# EAGLE design Hocki-IR-Receiver (EAGLE 9.6.2)
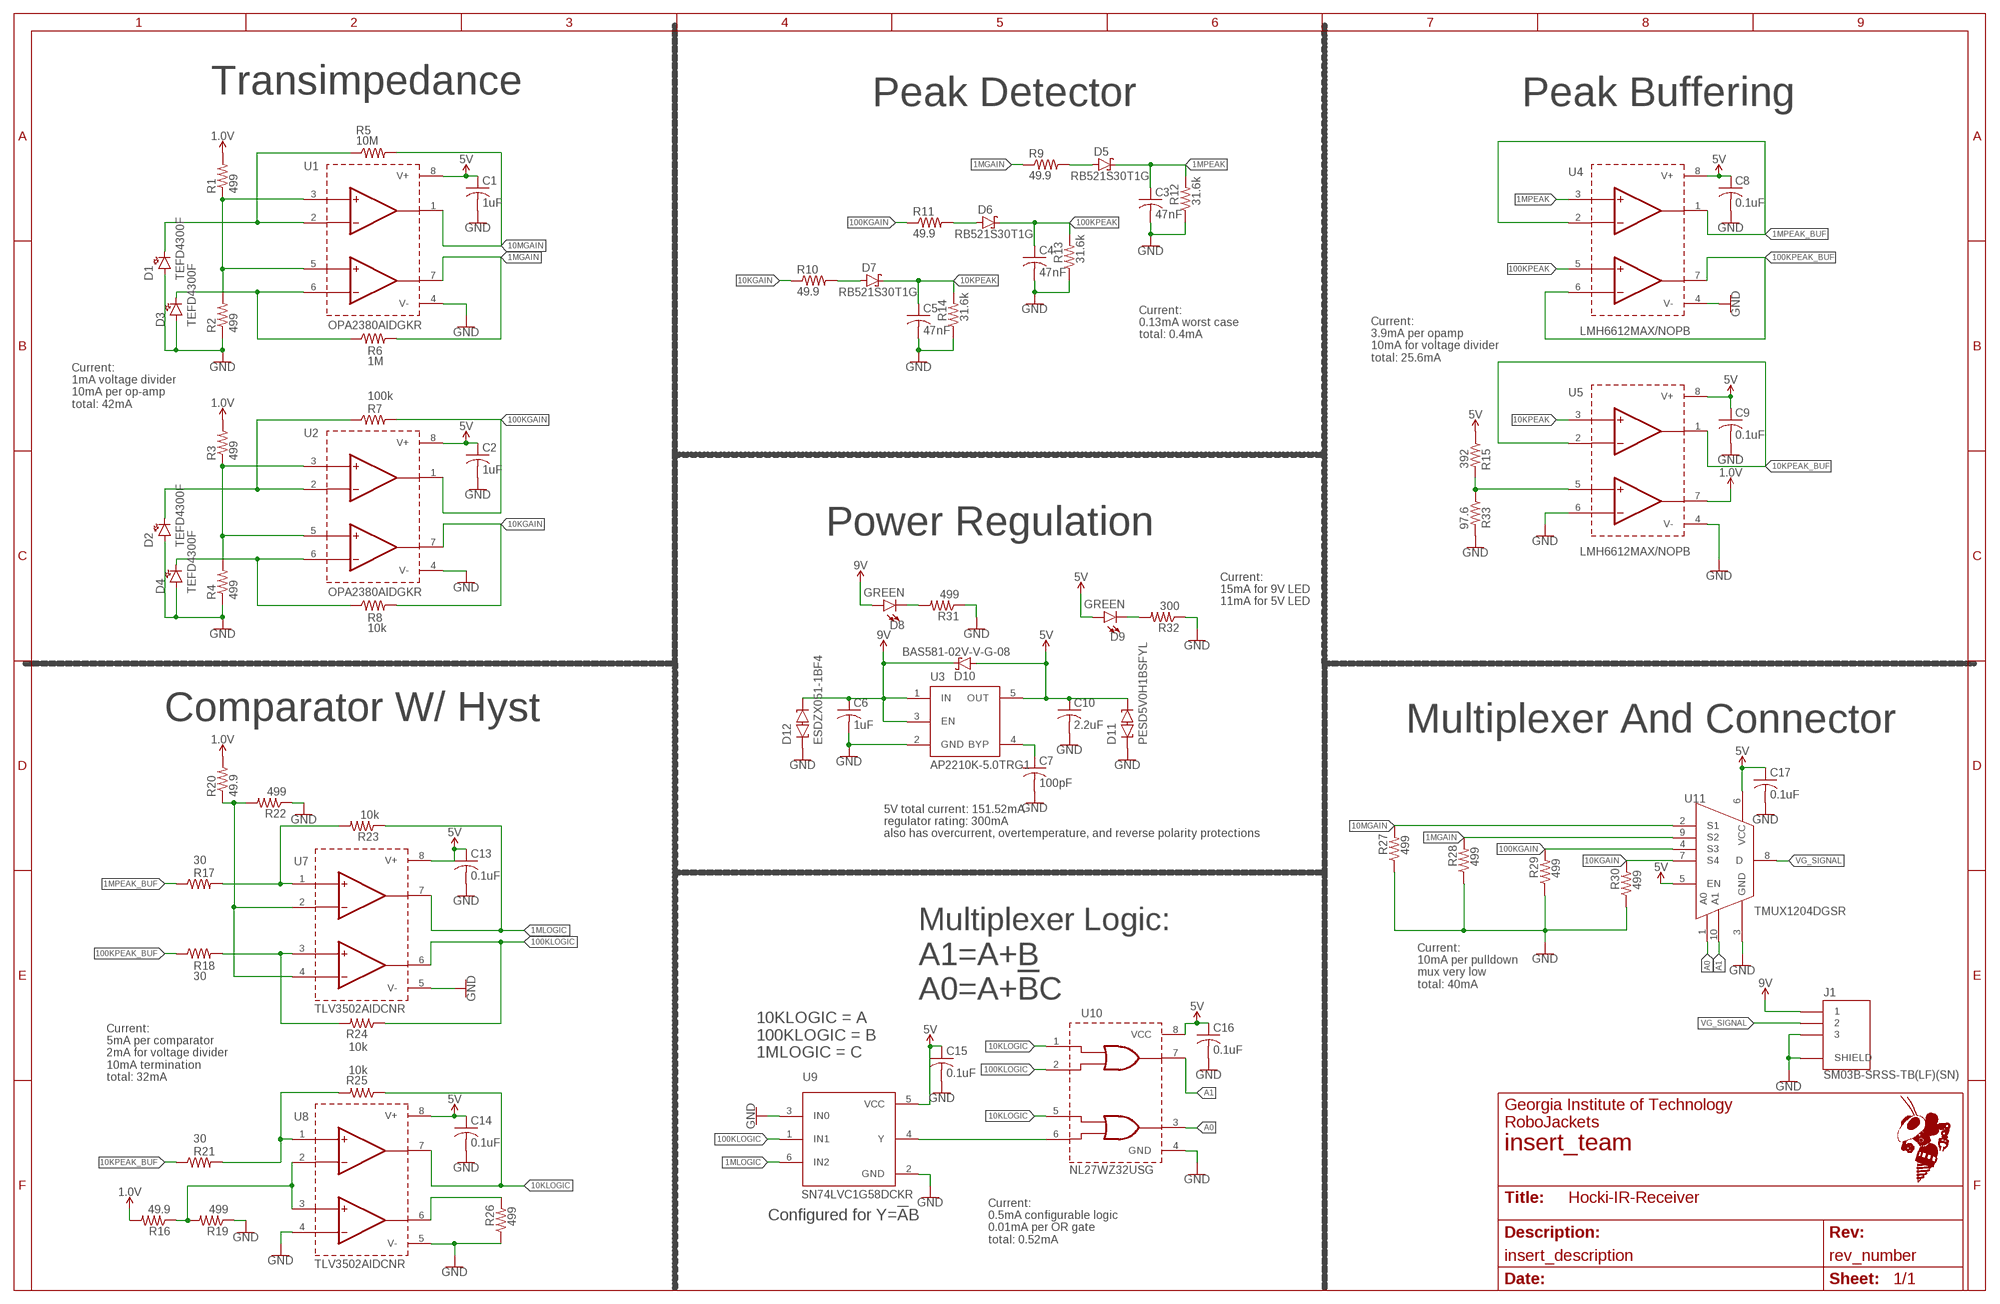
[diagram p0: schematic, sheet 1]
FRAME1 (FRAME_11_17): REVISION: rev_number; SCH_DESC: insert_description; TEAM: insert_team

## Parts
C1  1uF  C-USC0603  [C0603]
C2  1uF  C-USC0603  [C0603]
C3  47nF  C-USC1206  [C1206]
C4  47nF  C-USC1206  [C1206]
C5  47nF  C-USC1206  [C1206]
C6  1uF  C-USC0603  [C0603]
C7  100pF  C-USC0603  [C0603]
C8  0.1uF  C-USC0603  [C0603]
C9  0.1uF  C-USC0603  [C0603]
C10  2.2uF  C-USC0603  [C0603]
C13  0.1uF  C-USC0603  [C0603]
C14  0.1uF  C-USC0603  [C0603]
C15  0.1uF  C-USC0603  [C0603]
C16  0.1uF  C-USC0603  [C0603]
C17  0.1uF  C-USC0603  [C0603]
D1  TEFD4300F  [TEFD4300F]
D2  TEFD4300F  [TEFD4300F]
D3  TEFD4300F  [TEFD4300F]
D4  TEFD4300F  [TEFD4300F]
D5  RB521S30T1G  [SOD-523]
D6  RB521S30T1G  [SOD-523]
D7  RB521S30T1G  [SOD-523]
D8  GREEN  LED-GREEN0603  [LED-0603]
D9  GREEN  LED-GREEN0603  [LED-0603]
D10  BAS581-02V-V-G-08  [SOD-523]
D11  PESD5V0H1BSFYL  [DSN0603-2]
D12  ESDZX051-1BF4  [DSN0603-2]
J1  SM03B-SRSS-TB(LF)(SN)  [SM03B-SRSS-TB(LF)(SN)]
R1  499  R-US_R0603  [R0603]
R2  499  R-US_R0603  [R0603]
R3  499  R-US_R0603  [R0603]
R4  499  R-US_R0603  [R0603]
R5  10M  R-US_R1206  [R1206]
R6  1M  R-US_R0603  [R0603]
R7  100k  R-US_R0603  [R0603]
R8  10k  R-US_R0603  [R0603]
R9  49.9  R-US_R0603  [R0603]
R10  49.9  R-US_R0603  [R0603]
R11  49.9  R-US_R0603  [R0603]
R12  31.6k  R-US_R0603  [R0603]
R13  31.6k  R-US_R0603  [R0603]
R14  31.6k  R-US_R0603  [R0603]
R15  392  R-US_R0603  [R0603]
R16  49.9  R-US_R0603  [R0603]
R17  30  R-US_R0603  [R0603]
R18  30  R-US_R0603  [R0603]
R19  499  R-US_R0603  [R0603]
R20  49.9  R-US_R0603  [R0603]
R21  30  R-US_R0603  [R0603]
R22  499  R-US_R0603  [R0603]
R23  10k  R-US_R0603  [R0603]
R24  10k  R-US_R0603  [R0603]
R25  10k  R-US_R0603  [R0603]
R26  499  R-US_R0603  [R0603]
R27  499  R-US_R0603  [R0603]
R28  499  R-US_R0603  [R0603]
R29  499  R-US_R0603  [R0603]
R30  499  R-US_R0603  [R0603]
R31  499  R-US_R0603  [R0603]
R32  300  R-US_R0603  [R0603]
R33  97.6  R-US_R0603  [R0603]
U1  OPA2380AIDGKR  [8-VSSOP]
U2  OPA2380AIDGKR  [8-VSSOP]
U3  AP2210K-5.0TRG1  [SOT-23-5]
U4  LMH6612MAX/NOPB  [8-SOIC]
U5  LMH6612MAX/NOPB  [8-SOIC]
U7  TLV3502AIDCNR  [SOT-23-8]
U8  TLV3502AIDCNR  [SOT-23-8]
U9  SN74LVC1G58DCKR  [SC-70-6]
U10  NL27WZ32USG  [US8]
U11  TMUX1204DGSR  [10-VSSOP]

## Nets
1.0V: R1.2 R3.2 R16.2 R20.2 U5.7(OUTB)
1MGAIN: R6.2 R9.1 R28.2 U1.7(OUTB) U11.9(S2)
1MLOGIC: R23.1 U7.7(OUTA) U9.6(IN2)
1MPEAK: C3.1 D5.1(C) R12.2 U4.3(INA+)
1MPEAK_BUF: R17.1 U4.1(OUTA) U4.2(INA-)
5V: C1.1 C2.1 C8.1 C9.1 C10.1 C13.1 C14.1 C15.1 C16.1 C17.1 D9.A D10.2(A) D11.C2 R15.1 U1.8(V+) U2.8(V+) U3.5(OUT) U4.8(V+) U5.8(V+) U7.8(V+) U8.8(V+) U9.5(VCC) U10.8(VCC) U11.5(EN) U11.6(VCC)
9V: C6.1 D8.A D10.1(C) D12.C2 J1.1 U3.1(IN) U3.3(EN)
10KGAIN: R8.2 R10.1 R30.2 U2.7(OUTB) U11.7(S4)
10KLOGIC: R25.1 U8.7(OUTA) U10.1(A1) U10.5(A2)
10KPEAK: C5.1 D7.1(C) R14.2 U5.3(INA+)
10KPEAK_BUF: R21.1 U5.1(OUTA) U5.2(INA-)
10MGAIN: R5.2 R27.2 U1.1(OUTA) U11.2(S1)
100KGAIN: R7.2 R11.1 R29.2 U2.1(OUTA) U11.4(S3)
100KLOGIC: R24.1 U7.6(OUTB) U9.1(IN1) U10.2(B1)
100KPEAK: C4.1 D6.1(C) R13.2 U4.5(INB+)
100KPEAK_BUF: R18.1 U4.6(INB-) U4.7(OUTB)
A0: U10.3(Y2) U11.1(A0)
A1: U10.7(Y1) U11.10(A1)
GND: C1.2 C2.2 C3.2 C4.2 C5.2 C6.2 C7.2 C8.2 C9.2 C10.2 C13.2 C14.2 C15.2 C16.2 C17.2 D1.1(ANODE) D2.1(ANODE) D3.1(ANODE) D4.1(ANODE) D11.C1 D12.C1 J1.3 J1.S1(SHIELD) J1.S2(SHIELD) R2.1 R4.1 R12.1 R13.1 R14.1 R19.1 R22.1 R26.1 R27.1 R28.1 R29.1 R30.1 R31.1 R32.1 R33.2 U1.4(V-) U2.4(V-) U3.2(GND) U4.4(V-) U5.4(V-) U5.6(INB-) U7.5(V-) U8.4(INB-) U8.5(V-) U9.2(GND) U9.3(IN0) U10.4(GND) U11.3(GND)
N$1: D1.2(CATHODE) R5.1 U1.2(INA-)
N$2: D6.2(A) R11.2
N$3: D3.2(CATHODE) R6.1 U1.6(INB-)
N$4: D7.2(A) R10.2
N$5: R1.1 R2.2 U1.3(INA+) U1.5(INB+)
N$6: D2.2(CATHODE) R7.1 U2.2(INA-)
N$7: R26.2 U8.6(OUTB)
N$8: C7.1 U3.4(BYP)
N$9: U9.4(Y) U10.6(B2)
N$10: D4.2(CATHODE) R8.1 U2.6(INB-)
N$11: D9.C R32.2
N$12: R3.1 R4.2 U2.3(INA+) U2.5(INB+)
N$13: R20.1 R22.2 U7.2(INA-) U7.4(INB-)
N$14: R16.1 R19.2 U8.2(INA-) U8.3(INB+)
N$15: R15.2 R33.1 U5.5(INB+)
N$20: R18.2 R24.2 U7.3(INB+)
N$21: D5.2(A) R9.2
N$22: R21.2 R25.2 U8.1(INA+)
N$23: R17.2 R23.2 U7.1(INA+)
N$24: D8.C R31.2
VG_SIGNAL: J1.2 U11.8(D)

## Notes on the sheet
- Transimpedance | Peak Detector | Peak Buffering
- Current:
  0.13mA worst case
  total: 0.4mA
- Current:
  3.9mA per opamp
  10mA for voltage divider
  total: 25.6mA
- Current:
  1mA voltage divider
  10mA per op-amp
  total: 42mA
- Power Regulation
- Current:
  15mA for 9V LED
  11mA for 5V LED
- Comparator W/ Hyst | Multiplexer And Connector
- 5V total current: 151.52mA
  regulator rating: 300mA
  also has overcurrent, overtemperature, and reverse polarity protections
- Current:
  10mA per pulldown
  mux very low
  total: 40mA
- Multiplexer Logic:
  A1=A+B
  A0=A+!B!C
- 10KLOGIC = A
  100KLOGIC = B
  1MLOGIC = C
- Current:
  5mA per comparator
  2mA for voltage divider
  10mA termination
  total: 32mA
- Configured for Y=!A!B
- Current:
  0.5mA configurable logic
  0.01mA per OR gate
  total: 0.52mA

## Library data of the parts
C1-C10 C13-C17 = rcl:C-US: CAPACITOR, American symbol; SPICEPREFIX: C
D1-D4 = Hocki_Library:TEFD4300F: Photodiode 950nm 100ns 40° Radial DigiKey <https://www.digikey.com/product-detail/en/vishay-semiconductor-opto-division/TEFD4300F/TEFD4300F-ND/2987578>; DKPN: TEFD4300F-ND
D5-D7 = Hocki_Library:RB521S30T1G
D8 D9 = SparkFun-LED:LED-GREEN: Green SMD LED Used in manufacturing of various products at SparkFun Packages: 0603 - SMD 0603 package [Product Link] <http://www.futureelectronics.com/en/technologies/semiconductors/optoelectronics/leds/Pages/9894312-LTST-C190GKT.aspx?CrossPart=HSMG-C190&IM=0> LilyPad 1206 - SMD1206 LilyPad package [Product Link] <http://www.futureelectronics.com/en/Technologies/Product.aspx?ProductID=IN150NGHARVATEKCORPORATION2049943&IM=0> 1206 - SMD1206 package [Product Link] <http://www.futureelectronics.com/en/technologies/semiconductors/optoelectronics/leds/Pages/8315665-LTST-C150KGKT.aspx?IM=0> 1206 Bottom Mount -SMD 1206 Bottom Mount [Product Link] <http://www.digikey.com/product-detail/en/lite-on-inc/LTST-C230KGKT/160-1456-1-ND/386854> SparkFun Products: Pro Mini 328 -5V <https://www.sparkfun.com/products/821> RedBoard <https://www.sparkfun.com/products/12757> MP3 Trigger <https://www.sparkfun.com/products/13720> Makey Makey <https://www.sparkfun.com/products/11076>; PROD_ID: DIO-00821
D10 = Hocki_Library:BAS581-02V-V-G-08: Diode Schottky 40V 200mA Surface Mount SOD-523 DigiKey <https://www.digikey.com/product-detail/en/vishay-semiconductor-diodes-division/BAS581-02V-V-G-08/112-BAS581-02V-V-G-08CT-ND/8564684>; DKPN: 112-BAS581-02V-V-G-08CT-ND
D11 = Hocki_Library:PESD5V0H1BSFYL: 5V Clamp 7A (8/20µs) Ipp Tvs Diode Surface Mount DSN0603-2 DigiKey <https://www.digikey.com/product-detail/en/nexperia-usa-inc/PESD5V0H1BSFYL/1727-2675-1-ND/6576108>; DKPN: 1727-2675-1-ND
D12 = Hocki_Library:ESDZX051-1BF4: 10V (Typ) Clamp 4A (8/20µs) Ipp Tvs Diode Surface Mount ST0201 DigiKey <https://www.digikey.com/product-detail/en/stmicroelectronics/ESDZX051-1BF4/497-ESDZX051-1BF4CT-ND/12749584>; DKPN: 497-ESDZX051-1BF4CT-ND
J1 = Hocki_Library:SM03B-SRSS-TB(LF)(SN): Connector Header Surface Mount, Right Angle 3 position 0.039" (1.00mm) DigiKey <https://www.digikey.com/product-detail/en/jst-sales-america-inc/SM03B-SRSS-TB-LF-SN/455-1803-1-ND/926874>; DKPN: 455-1803-1-ND
R1-R4 R6-R33 = resistor:R-US_: RESISTOR, American symbol
R5 = rcl:R-US_: RESISTOR, American symbol; SPICEPREFIX: R
U1 U2 = Hocki_Library:OPA2380AIDGKR: Transimpedance Amplifier 2 Circuit 8-VSSOP Digikey <https://www.digikey.com/product-detail/en/texas-instruments/OPA2380AIDGKR/296-48627-1-ND/8567671>; DKPN: 296-48627-1-ND
U3 = Hocki_Library:AP2210K-*TRG1: Linear Voltage Regulator IC 1 Output 300mA SOT-23-5 3.3V DigiKey <https://www.digikey.com/product-detail/en/diodes-incorporated/AP2210K-3-3TRG1/AP2210K-3-3TRG1DICT-ND/4505291> 5.0V DigiKey <https://www.digikey.com/product-detail/en/diodes-incorporated/AP2210K-5-0TRG1/AP2210K-5-0TRG1DICT-ND/4505292>; DKPN: AP2210K-5.0TRG1DICT-ND
U4 U5 = Hocki_Library:LMH6612MAX/NOPB: General Purpose Amplifier 2 Circuit Rail-to-Rail 8-SOIC DigiKey <https://www.digikey.com/product-detail/en/texas-instruments/LMH6612MAX-NOPB/296-46310-1-ND/7033484>; DKPN: 296-46310-1-ND
U7 U8 = Hocki_Library:TLV3502AIDCNR: Comparator General Purpose CMOS, Push-Pull, Rail-to-Rail, TTL SOT-23-8 DigiKey <https://www.digikey.com/product-detail/en/texas-instruments/TLV3502AIDCNR/296-39267-1-ND/5143259>; DKPN: 296-39267-1-ND
U9 = Hocki_Library:SN74LVC1G58DCKR: Configurable Multiple Function Configurable 1 Circuit 3 Input SC-70-6 DigiKey< <https://www.digikey.com/product-detail/en/texas-instruments/SN74LVC1G58DCKR/296-15577-1-ND/571153>; DKPN: 296-15577-1-ND
U10 = Hocki_Library:NL27WZ32USG: OR Gate IC 2 Channel US8 DigiKey <https://www.digikey.com/product-detail/en/on-semiconductor/NL27WZ32USG/NL27WZ32USGOSCT-ND/964591>; DKPN: NL27WZ32USGOSCT-ND
U11 = Hocki_Library:TMUX1204DGSR: Multiplexer 1 Circuit IC Switch 4:1 5Ohm (Typ) 10-VSSOP DigiKey <https://www.digikey.com/product-detail/en/texas-instruments/TMUX1204DGSR/296-TMUX1204DGSRCT-ND/10435076>; DKPN: 296-TMUX1204DGSRCT-ND

## Board
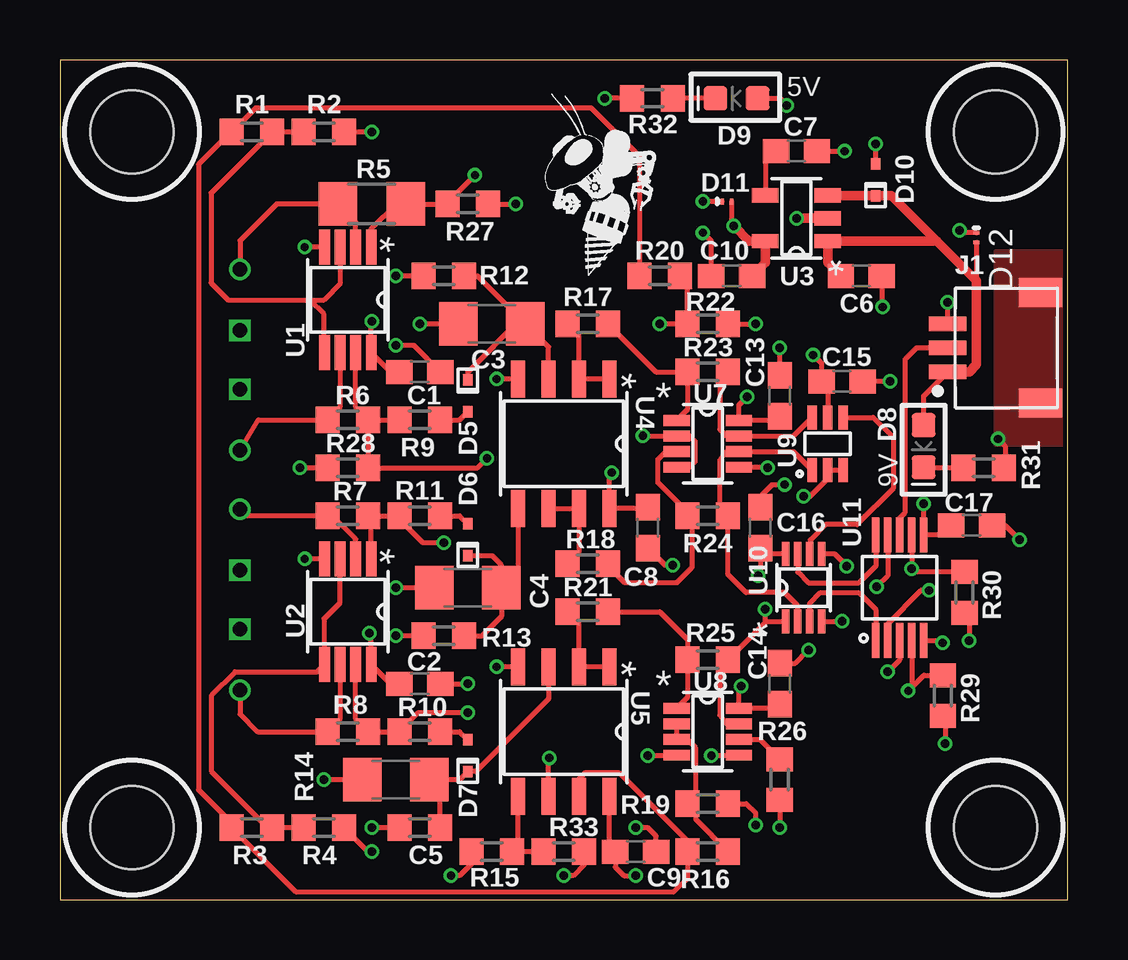
[diagram p1: board, top side]
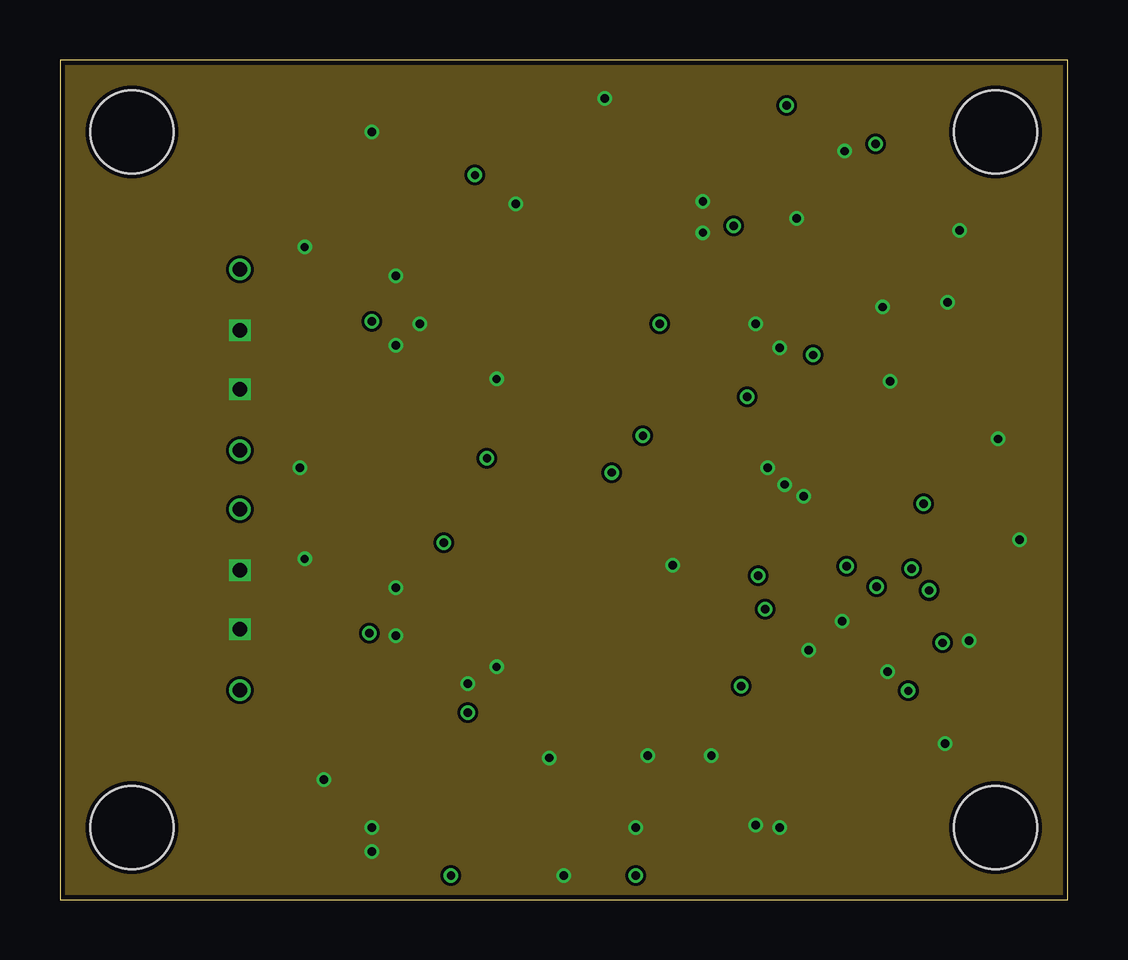
[diagram p2: board, inner layer GND]
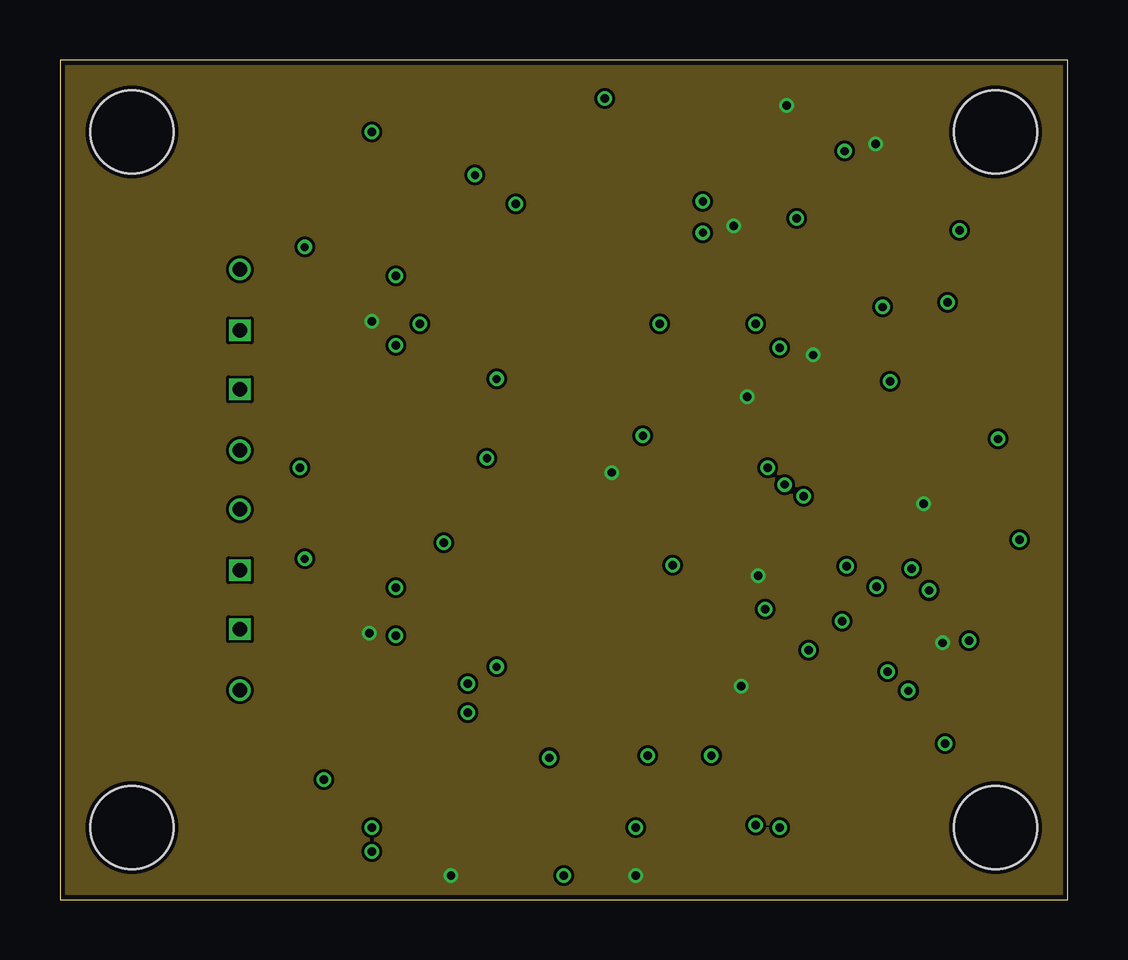
[diagram p3: board, inner layer Power]
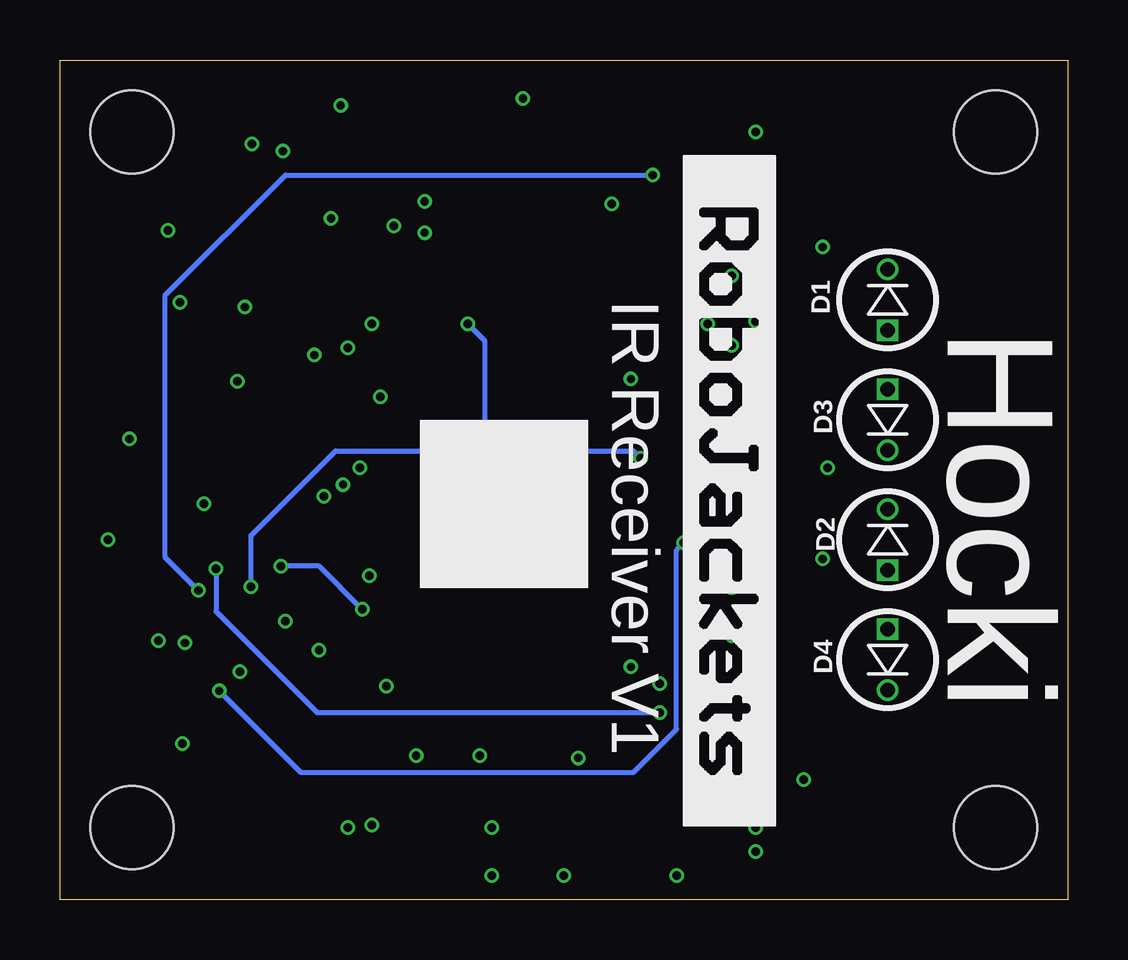
[diagram p4: board, bottom side, seen from below]

Size 42 x 35 mm. Coordinates in mm from the lower left corner, seen from the top.
Outline: 0,0 42,0 42,35 0,35 0,0
Copper layers (1+2*15+16): Top 0.035mm / dielectric 0.2mm / GND 0.0175mm / dielectric 1.065mm / Power 0.0175mm / dielectric 0.2mm / Bottom 0.035mm
Design rules "JLCPCB (4 Layer)": minimum track width 5mil, minimum drill 0.2mm, track to track 5mil, track to pad 5mil, pad to pad 5mil, via to via 20mil, smd to smd 5mil, copper to edge 0.2mm, drill to drill 21mil, minimum pad ring 6mil, minimum via ring 5mil, stop-mask expansion 6mil, vias tented up to drill 30mil, thermal gap 10mil
Holes 3.45 mm at 39,3 39,32 3,32 3,3

### Footprints (pad centres in the part's own frame; a part is rotated, then mirrored left to right if it is on the bottom)
C0603 = smd 1.1 x 1: 1 -0.85,0; 2 0.85,0
C1206 = smd 1.6 x 1.8: 1 -1.4,0; 2 1.4,0
TEFD4300F = drill 0.6 square: 1 -1.27,0 | drill 0.6: 2 1.27,0
SOD-523 = smd 0.48 x 0.4: 1 -0.66,0; 2 0.66,0
LED-0603 = smd 1 x 1: A -0.877,0; C 0.877,0
DSN0603-2 = smd 0.15 x 0.25: C1 -0.2,0; C2 0.2,0
SM03B-SRSS-TB(LF)(SN) = smd 0.6 x 1.55: 1 -1,0; 2 0,0; 3 1,0 | smd 1.2 x 1.8: S1 -2.3,-3.875; S2 2.3,-3.875
R0603 = smd 1 x 1.1: 1 -0.85,0; 2 0.85,0
R1206 = smd 1.6 x 1.803: 1 -1.422,0; 2 1.422,0
8-VSSOP = smd 1.45 x 0.45: 1 -2.2,0.975; 2 -2.2,0.325; 3 -2.2,-0.325; 4 -2.2,-0.975; 5 2.2,-0.975; 6 2.2,-0.325; 7 2.2,0.325; 8 2.2,0.975
SOT-23-5 = smd 1.1 x 0.6: 1 -1.3,0.95; 2 -1.3,0; 3 -1.3,-0.95; 4 1.3,-0.95; 5 1.3,0.95
8-SOIC = smd 1.55 x 0.6: 1 -2.7,1.905; 2 -2.7,0.635; 3 -2.7,-0.635; 4 -2.7,-1.905; 5 2.7,-1.905; 6 2.7,-0.635; 7 2.7,0.635; 8 2.7,1.905
SOT-23-8 = smd 1.1 x 0.45: 1 -1.3,0.975; 2 -1.3,0.325; 3 -1.3,-0.325; 4 -1.3,-0.975; 5 1.3,-0.975; 6 1.3,-0.325; 7 1.3,0.325; 8 1.3,0.975
SC-70-6 = smd 1 x 0.4: 1 -1.1,0.65; 2 -1.1,0; 3 -1.1,-0.65; 4 1.1,-0.65; 5 1.1,0; 6 1.1,0.65
US8 = smd 1 x 0.3: 1 -1.4,0.75; 2 -1.4,0.25; 3 -1.4,-0.25; 4 -1.4,-0.75; 5 1.4,-0.75; 6 1.4,-0.25; 7 1.4,0.25; 8 1.4,0.75
10-VSSOP = smd 1.45 x 0.3: 1 -2.2,1; 2 -2.2,0.5; 3 -2.2,0; 4 -2.2,-0.5; 5 -2.2,-1; 6 2.2,-1; 7 2.2,-0.5; 8 2.2,0; 9 2.2,0.5; 10 2.2,1

### Placement (x,y rotation side)
C1  15,22 0 top
C2  15,9 0 top
C3  18,24 180 top
C4  17,13 180 top
C5  14,5 180 top
C6  33.4,26 0 top
C7  30.7,31.2 0 top
C8  24.5,15.5 270 top
C9  24,2 0 top
C10  28,26 180 top
C13  30,21 90 top
C14  30,9 90 top
C15  32.6,21.6 0 top
C16  29.2,15.5 90 top
C17  38,15.6 0 top
D1  7.5,25 90 bottom
D2  7.5,15 90 bottom
D3  7.5,20 270 bottom
D4  7.5,10 270 bottom
D5  17,21 270 top
D6  17,15 90 top
D7  17,6 90 top
D8  36,18.9 270 top
D9  28.2,33.4 180 top
D10  34,30 90 top
D11  27.8,29.1 0 top
D12  38.2,27.6 270 top
J1  37,23 90 top
R1  8,32 180 top
R2  11,32 180 top
R3  8,3 180 top
R4  11,3 180 top
R5  13,29 0 top
R6  12,20 0 top
R7  12,16 0 top
R8  12,7 0 top
R9  15,20 0 top
R10  15,7 0 top
R11  15,16 0 top
R12  16,26 0 top
R13  16,11 0 top
R14  15,3 0 top
R15  18,2 0 top
R16  27,2 180 top
R17  22,24 0 top
R18  22,14 0 top
R19  27,4 180 top
R20  25,26 180 top
R21  22,12 0 top
R22  27,24 180 top
R23  27,22 180 top
R24  27,16 180 top
R25  27,10 180 top
R26  30,5 90 top
R27  17,29 180 top
R28  12,18 0 top
R29  36.8,8.5 90 top
R30  37.7,12.8 90 top
R31  38.5,18 180 top
R32  24.7,33.4 0 top
R33  21,2 0 top
U1  12,25 270 top
U2  12,12 270 top
U3  30.7,28.4 180 top
U4  21,19 270 top
U5  21,7 270 top
U7  27,19 0 top
U8  27,7 0 top
U9  32,19 90 top
U10  31,13 90 top
U11  35,13 90 top
U$1  [ROBOBUZZ_0.4X]  22,26 0 top
U$2  [ROBOJACKETS]  16,31 270 bottom

### Tracks (layer width: path | path; a pad name or v marks a point on that pad's centre or on a via)
1.0V
  Top 0.2: R20.2 24.15,31 22.15,33 8.15,33 R1.2 7.12,32 5.77,30.65 5.77,4.58 7.15,3.2 R3.2 9.83,0.32 25.6,0.32 26.15,0.87 R16.2 26.15,2.45 23.3,5.3 21.91,5.3 21.64,5.03 U5.7
1MGAIN  (via drill 0.35)
  Top 0.2: U11.9 34.5,13.5 v34.05,13.05 | R6.2 12.32,20.52 U1.7 | v17.8,18.4 17.4,18 R28.2 R6.2 | R6.2 R9.1
  Bottom 0.2: v34.05,13.05 34.05,15.16 30.51,18.7 18.1,18.7 v17.8,18.4
1MLOGIC
  Top 0.2: R23.1 27.5,21.65 27.5,19.6 27.77,19.32 U7.7 30.57,19.32 U9.6
1MPEAK
  Top 0.2: 19.2,24.2 C3.1 20.36,23.04 U4.3 | 19.2,24.2 17.4,26 R12.2 | D5.1 17,22 19.2,24.2
1MPEAK_BUF
  Top 0.2: U4.1 U4.2 21.64,23.52 R17.1
5V  (via drill 0.35)
  Top 0.2: C1.1 13.78,22 U1.8 12.97,24.07 v13,24.1 | C2.1 13.78,9 U2.8 12.97,11.01 v12.89,11.1 | U5.8 22.91,2.25 C9.1 23.15,1.35 23.5,1 v24,1 | C14.1 29.82,7.97 U8.8 28.3,8.79 v28.4,8.89 | C8.1 24.45,16.3 U4.8 22.91,17.7 v23,17.8 | C13.1 29.82,19.98 U7.8 28.3,20.61 v28.64,20.96 | C17.1 36.75,15.2 U11.6 v36,16.5 | U11.5 36.69,10.8 v36.79,10.7 | U10.8 29.45,14.4 C16.1 29.2,13.6 v29.1,13.5 | D9.A 30,33.4 v30.3,33.1 | D10.2 v34,31.5 | U9.5 32,21.35 C15.1 31.75,22.35 v31.4,22.7 | R15.1 17.15,1.5 16.65,1 v16.3,1 | v28.09,28.09 28,28.17 D11.C2
  Top 0.4: v28.09,28.09 28.72,27.45 U3.5 29.4,26.55 C10.1
  pour Power (no thermals): 0,35 0,0 42,0 42,35
9V
  Top 0.2: D8.A 36,21 J1.1 | D12.C2 38.2,25.8
  Top 0.4: 36.55,27.45 U3.1 32,26.55 C6.1 | 36.55,27.45 38.2,25.8 38.2,22.3 37.9,22 J1.1 | 36.55,27.45 34.65,29.35 D10.1 U3.3
10KGAIN  (via drill 0.35)
  Top 0.2: U11.7 v35.5,13.8 35.65,13.65 R30.2 | v17,7.8 14.95,7.8 R10.1 R8.2 12.32,7.53 U2.7
  Bottom 0.2: v35.5,13.8 35.5,12.01 31.29,7.8 v17,7.8
10KLOGIC  (via drill 0.35)
  Top 0.2: U8.7 27.78,7.33 27.5,7.68 27.5,9.55 R25.1 29.4,11.55 | v32.8,13.9 32.3,14.4 U10.5 | 29.4,11.55 v29.4,12.1 | 29.4,11.55 29.45,11.6 U10.1
  Bottom 0.2: v29.4,12.1 31.2,13.9 v32.8,13.9
10KPEAK
  Top 0.2: R14.2 15.85,4.55 C5.1 16.66,5 D7.1 17.34,5.34 20.36,8.37 U5.3
10KPEAK_BUF
  Top 0.2: U5.1 U5.2 21.64,11.52 R21.1
10MGAIN  (via drill 0.35)
  Top 0.2: U11.2 34.5,11.5 35.89,12.89 v36.23,12.89 | v17.3,30.2 16.15,29.05 R27.2 R5.2 14,29 12.97,27.98 U1.1
  Bottom 0.2: v36.23,12.89 37.63,14.29 37.63,25.17 32.6,30.2 v17.3,30.2
100KGAIN  (via drill 0.35)
  Top 0.2: U11.4 35.5,8.84 v35.36,8.7 36.01,9.35 R29.2 | U2.1 12.97,15.88 R7.2 14,16 | 14,16 R11.1 | 14,16 15.13,14.87 v16,14.87
  Bottom 0.2: v35.36,8.7 31.96,5.3 18.1,5.3 16.3,7.1 16.3,14.57 v16,14.87
100KLOGIC
  Top 0.2: U9.1 30.57,18.68 U7.6 27.78,18.68 27.5,18.32 27.5,16.45 R24.1 27.85,13.55 28.6,12.8 30.2,12.8 30.75,12.25 U10.2
100KPEAK
  Top 0.2: C4.1 18.4,11.8 17.6,11 R13.2 | D6.1 18,14.34 18.4,13.94 C4.1 | U4.5 19.09,13.7 C4.1
100KPEAK_BUF
  Top 0.2: U4.6 U4.7 21.64,14.48 R18.1
A0
  Top 0.2: U10.3 31.25,12.35 31.7,12.8 33.3,12.8 34,12.1 U11.1
A1
  Top 0.2: U10.7 30.75,13.65 31.2,13.2 33.3,13.2 34,13.9 U11.10
GND  (via drill 0.35)
  Top 0.2: v13,32 R2.1 | R13.1 v14,11 | R12.1 v14,26 | U4.4 v18.2,21.7 | R22.1 v29,24 | U7.5 29.48,18.02 v29.5,18 | U8.4 25.68,6 v24.5,6 | U8.5 28.27,6 v27.16,6 | R26.1 v30,3 | v29,3.1 29,3.6 28.6,4 R19.1 | U10.4 v32.6,11.6 | C1.2 14.75,23.1 v14,23.1 | C2.2 v17,9 | v25.54,13.94 25.21,13.94 C8.2 | C9.2 24.85,2.65 24.5,3 v24,3 | C13.2 v30,23 | C14.2 30.65,9.85 v31.2,10.4 | v34.6,21.6 C15.2 | U11.3 35,9.99 v34.5,9.49 | R27.1 v19,29 | R28.1 v10,18 | R29.1 36.9,7.55 v36.9,6.5 | R30.1 37.9,11.75 v37.9,10.8 | C17.2 39.4,15.6 v40,15 | C3.2 v15,24 | C4.2 v14,13 | C5.2 v11,5 | R4.1 12.85,2 v13,2 | R14.1 v13,3 | C7.2 v32.7,31.2 | C10.2 27.15,27.45 v26.8,27.8 | C6.2 34.25,24.75 v34.3,24.7 | J1.3 v37,24.9 | C16.2 29.2,16.8 29.7,17.3 v30.2,17.3 | U9.3 U9.2 31.98,17.88 31.98,17.51 31.29,16.82 v31,16.82 | R32.1 v22.7,33.4 | v39.1,19.2 39.4,18.9 39.4,18.05 R31.1 | U2.4 v10.2,14.2 | U1.4 v10.2,27.2 | U5.6 20.36,5.87 v20.4,5.91 | R33.2 21.85,1.45 21.4,1 v21,1 | U5.4 v18.2,9.7 | D11.C1 v26.8,29.1 | D12.C1 37.6,27.8 v37.5,27.9
  Top 0.4: U3.2 v30.7,28.4
  pour GND (no thermals): 0,35 0,0 42,0 42,35
  pour Top (no thermals): 42,27 39,27 39,19 42,19
N$1
  Top 0.2: U1.2 12.32,28.25 R5.1 9.03,29 7.5,27.47 D1.2
N$2
  Top 0.2: R11.2 16.66,16 D6.2
N$3
  Top 0.2: D3.2 8.27,20 R6.1 11.68,20.52 U1.6
N$4
  Top 0.2: R10.2 16.66,7 D7.2
N$5
  Top 0.2: R2.2 R1.1 6.3,29.45 6.3,25.7 7,25 10.4,25 | 10.4,25 11,25 11.68,25.68 U1.3 | U1.5 11,22.82 11,24.4 10.4,25
N$6
  Top 0.2: U2.2 12.32,15.03 11.35,16 R7.1 7.77,16 D2.2
N$7
  Top 0.2: U8.6 29.18,6.67 R26.2
N$8
  Top 0.2: C7.1 29.4,30.75 U3.4
N$9
  Top 0.2: U10.6 31.27,14.42 31.27,14.99 31.91,15.63 33.22,15.63 34.73,17.14 34.73,19.26 33.89,20.1 U9.4
N$10
  Top 0.2: U2.6 11.68,7.53 R8.1 8.23,7 7.5,7.73 D4.2
N$11
  Top 0.2: D9.C R32.2
N$12
  Top 0.2: R4.2 R3.1 8.65,3 6.33,5.33 6.33,8.53 7.3,9.5 10.72,9.5 U2.5 11,9.82 11,11.7 11.68,12.38 U2.3
N$13  (via drill 0.35)
  Top 0.2: R20.1 26.15,25.7 R22.2 v25,24 | v24.3,19.33 v24.31,19.32 U7.2 26.24,19.33 26.48,19.09 26.48,18.26 26.24,18.02 U7.4
  Bottom 0.2: v25,24 24.3,23.3 v24.3,19.33
N$14
  Top 0.2: R19.2 26.5,4.35 | 26.5,4.35 26.5,6.32 26.15,6.67 U8.3 U8.2 | R16.1 26.5,3.35 26.5,4.35
N$15
  Top 0.2: R33.1 R15.2 19.09,2.25 U5.5
N$20
  Top 0.2: R18.2 22.85,13.9 23.55,13.2 25.7,13.2 26.35,13.85 26.35,15.8 R24.2 26.15,16.15 24.92,17.38 24.92,18.34 25.26,18.68 U7.3
N$21
  Top 0.2: R9.2 16.66,20 D5.2
N$22
  Top 0.2: U8.1 26.15,8.43 R25.2 26.15,10.85 25,12 R21.2
N$23
  Top 0.2: U7.1 26.15,20.43 R23.2 24.85,22 R17.2
N$24
  Top 0.2: R31.2 36.02,18 D8.C
VG_SIGNAL
  Top 0.2: J1.2 35.7,23 35.23,22.53 35.23,16.14 35,15.91 U11.8

### Text on the board
tPlace: 5V | 9V
bPlace: IR Receiver V1 | Hocki